# EAGLE design SparkFun_Noisy_Cricket (EAGLE 9.6.2)
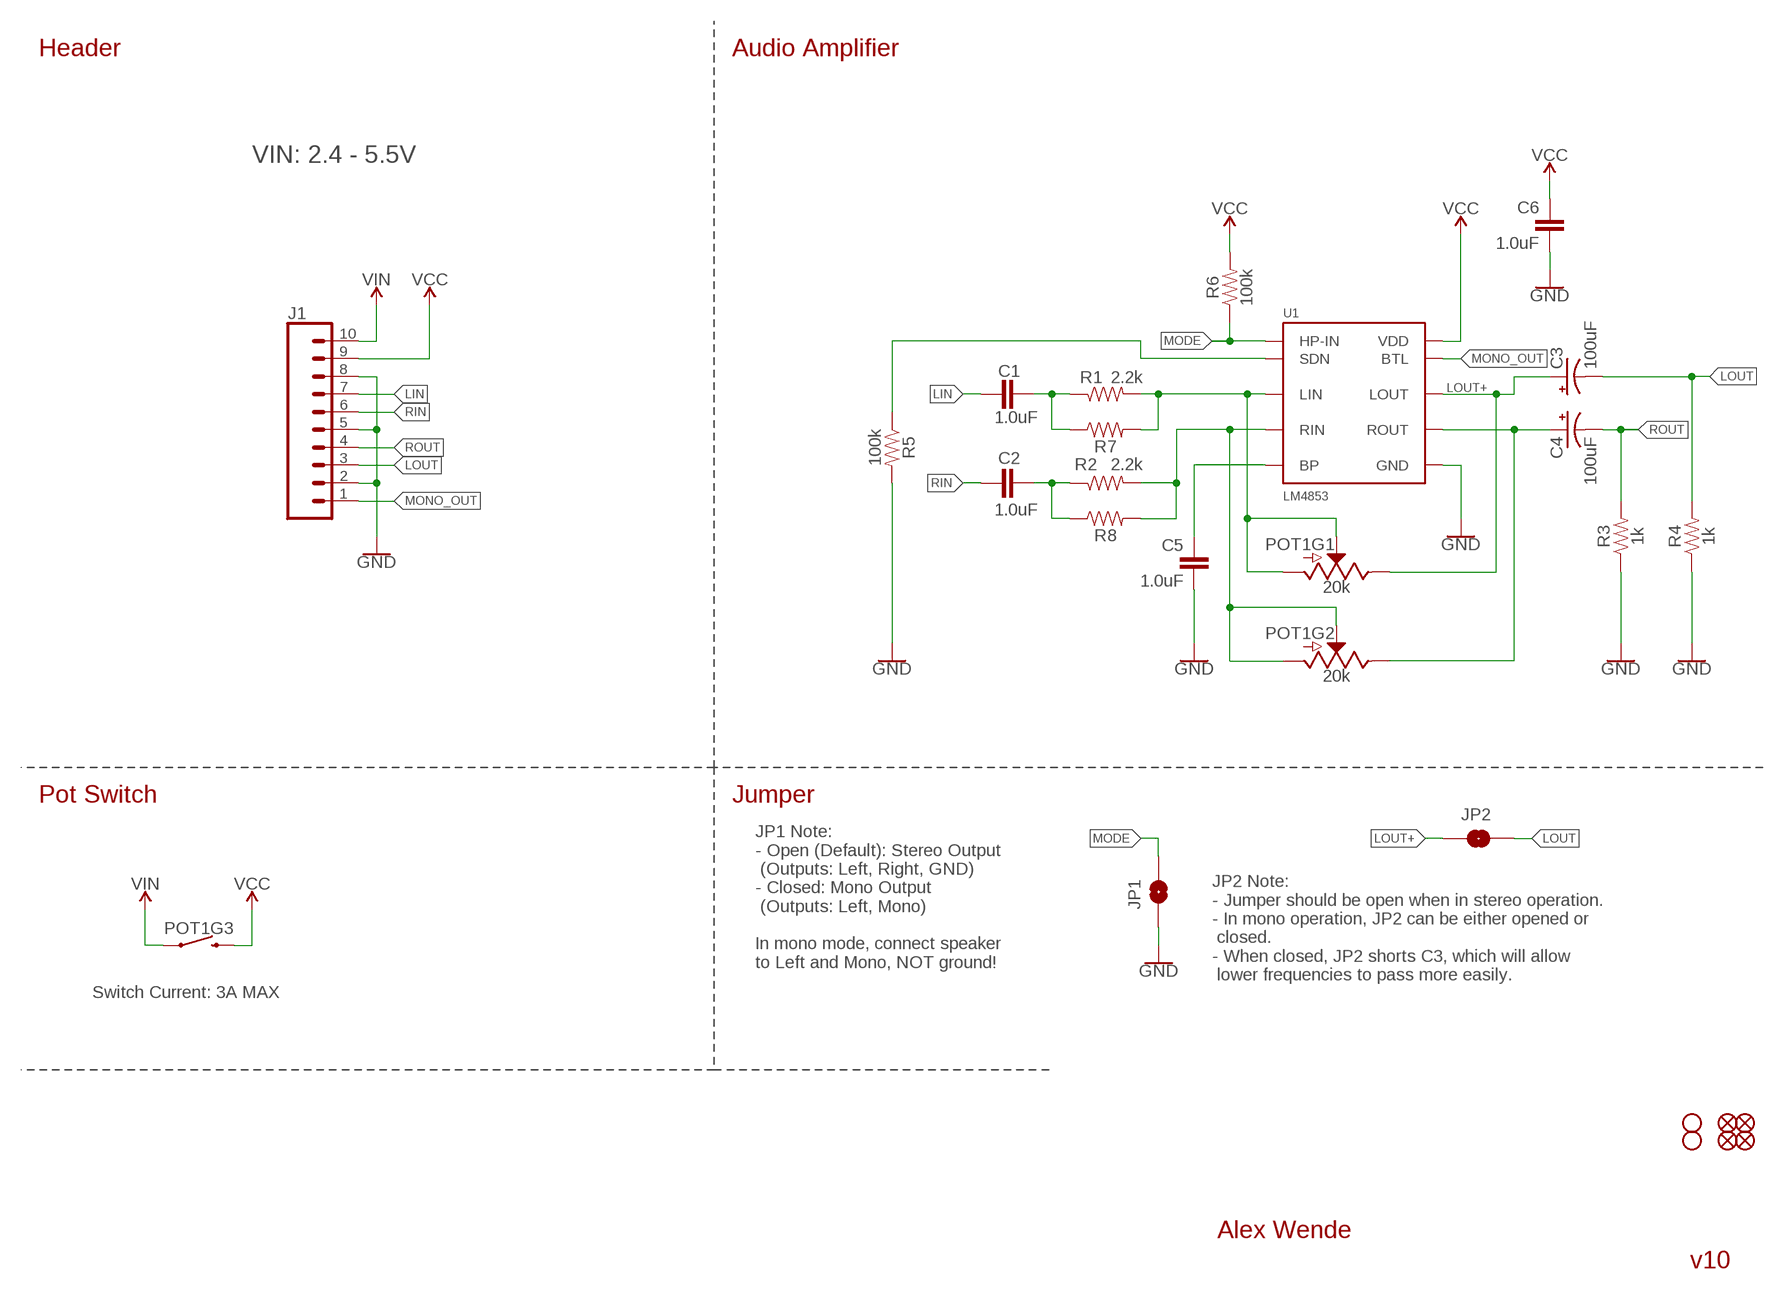
[diagram p0: schematic, sheet 1]

## Parts
C1  1.0uF  1.0UF-0603-16V-10%-X7R  [0603]
C2  1.0uF  1.0UF-0603-16V-10%-X7R  [0603]
C3  100uF  100UF-POLAR-25V-20%(ELEC)  [PANASONIC_D]
C4  100uF  100UF-POLAR-25V-20%(ELEC)  [PANASONIC_D]
C5  1.0uF  1.0UF-0603-16V-10%-X7R  [0603]
C6  1.0uF  1.0UF-0603-16V-10%-X7R  [0603]
FD1  FIDUCIALUFIDUCIAL  [FIDUCIAL-MICRO]
FD2  FIDUCIALUFIDUCIAL  [FIDUCIAL-MICRO]
FD3  FIDUCIALUFIDUCIAL  [FIDUCIAL-MICRO]
FD4  FIDUCIALUFIDUCIAL  [FIDUCIAL-MICRO]
H1  STAND-OFF  [STAND-OFF]
H2  STAND-OFF  [STAND-OFF]
J1  CONN_10NO_SILK_PTH_FEMALE  [1X10_NO_SILK]
JP1  JUMPER-SMT_2_NO_NO-SILK  [SMT-JUMPER_2_NO_NO-SILK]
JP2  JUMPER-SMT_2_NO_NO-SILK  [SMT-JUMPER_2_NO_NO-SILK]
POT1  20k  POTENTIOMETER_DUAL_W/SWITCH  [POT-DUAL-SWITCH-PTH]
R1  2.2k  2.2KOHM-0603-1/10W-1%  [0603]
R2  2.2k  2.2KOHM-0603-1/10W-1%  [0603]
R3  1k  1KOHM-0603-1/10W-1%  [0603]
R4  1k  1KOHM-0603-1/10W-1%  [0603]
R5  100k  100KOHM-0603-1/10W-1%  [0603]
R6  100k  100KOHM-0603-1/10W-1%  [0603]
R7  RESISTORAXIAL-0.3-KIT  [AXIAL-0.3-KIT]
R8  RESISTORAXIAL-0.3-KIT  [AXIAL-0.3-KIT]
U1  LM4853  [TFSOP-10]

## Nets
5V: C6.1 J1.9 POT1.SW2 R6.2 U1.VDD ; supply symbol labelled VCC
GND: C5.2 C6.2 J1.2 J1.5 J1.8 JP1.1 R3.1 R4.1 R5.2 U1.GND
LIN: C1.1 J1.7
LOUT: C3.- J1.3 JP2.2 R4.2
LOUT+: C3.+ JP2.1 POT1.A3(E) U1.LOUT
MODE: JP1.2 R6.1 U1.HP-IN
MONO_OUT: J1.1 U1.BTL
N$3: C1.2 R1.1 R7.P$1
N$5: C5.1 U1.BP
N$6: C2.2 R2.1 R8.P$1
N$9: R5.1 U1.SDN
N$12: C4.+ POT1.B3(E) U1.ROUT
N$21: POT1.A1(A) POT1.A2(S) R1.2 R7.P$2 U1.LIN
N$24: POT1.B1(A) POT1.B2(S) R2.2 R8.P$2 U1.RIN
RIN: C2.1 J1.6
ROUT: C4.- J1.4 R3.2
VIN: J1.10 POT1.SW1

## Notes on the sheet
- Header | Audio Amplifier
- VIN: 2.4 - 5.5V
- Pot Switch | Jumper
- JP1 Note:
  - Open (Default): Stereo Output
   (Outputs: Left, Right, GND)
  - Closed: Mono Output
   (Outputs: Left, Mono)
  
  In mono mode, connect speaker 
  to Left and Mono, NOT ground!
- JP2 Note:
  - Jumper should be open when in stereo operation.
  - In mono operation, JP2 can be either opened or
   closed.
  - When closed, JP2 shorts C3, which will allow
   lower frequencies to pass more easily.
- Switch Current: 3A MAX
- Alex Wende
- v10

## Library data of the parts
C1 C2 C5 C6 = SparkFun-Capacitors:1.0UF: 1µF ceramic capacitors A capacitor is a passive two-terminal electrical component used to store electrical energy temporarily in an electric field.; PROD_ID: CAP-13930
C3 C4 = SparkFun-Capacitors:100UF-POLAR: 100µF polarized capacitors A capacitor is a passive two-terminal electrical component used to store electrical energy temporarily in an electric field.; PROD_ID: CAP-12547
FD1-FD4 = SparkFun-Aesthetics:FIDUCIAL: Fiducial Alignment Points Point-of-reference for pick-and-place machines and other optical instruments.
H1 H2 = SparkFun-Hardware:STAND-OFF: Stand Off Drill holes for mechanically mounting via screws, standoffs, etc. Note: Use the keepout ring to avoid running the screw head into surrounding components. Variant Overviews STAND-OFF - Mechanical footprint for a #4 phillips button head screw. STAND-OFF-TIGHT - Mechanical footprint for a #4 phillips button head screw, Example SparkFun Products Screw - Phillips Head (1/4", 4-40, 10 pack) <https://www.sparkfun.com/products/10453> (PRT-10453) Screw - Phillips Head (1/2", 4-40, 10 pack) <https://www.sparkfun.com/products/10452> (PRT-10452) Screw - Phillips Head (3/4", 4-40, 10 pack) <https://www.sparkfun.com/products/10451> (PRT-10451) Screw - Phillips Head (1", 4-40, 10 pack) <https://www.sparkfun.com/products/10450> (PRT-10450)
J1 = SparkFun-Connectors:CONN_10: Multi connection point. Often used as Generic Header-pin footprint for 0.1 inch spaced/style header connections On any of the 0.1 inch spaced packages, you can populate with these: Break Away Headers - Straight <https://www.sparkfun.com/products/116> (PRT-00116) Break Away Male Headers - Right Angle <https://www.sparkfun.com/products/553> (PRT-00553) Female Headers <https://www.sparkfun.com/products/115> (PRT-00115) Break Away Headers - Machine Pin <https://www.sparkfun.com/products/117> (PRT-00117) Break Away Female Headers - Swiss Machine Pin <https://www.sparkfun.com/products/743> (PRT-00743) Arduino Stackable Header - 10 Pin <https://www.sparkfun.com/products/11376> (PRT-11376) For SCREWTERMINALS and SPRING TERMINALS visit here: Screw Terimnals on SparkFun.com <https://www.sparkfun.com/search/results?term=Screw+Terminals> (5mm/3.5mm/2.54mm spacing) This device is also useful as a general connection point to wire up your design to another part of your project. Our various solder wires solder well into these plated through hole pads. Hook-Up Wire - Assortment (Stranded, 22 AWG) <https://www.sparkfun.com/products/11375> (PRT-11375) Hook-Up Wire - Assortment (Solid Core, 22 AWG) <https://www.sparkfun.com/products/11367> (PRT-11367) View the entire wire category on our website here <https://www.sparkfun.com/categories/141> Special notes: Molex polarized connector foot print use with SKU : PRT-08231 with associated crimp pins and housings. 1MM SMD Version SKU: PRT-10208 NOTES ON THE VARIANTS LOCK and LOCK_LONGPADS... This footprint was designed to help hold the alignment of a through-hole component (i.e. 6-pin header) while soldering it into place. You may notice that each hole has been shifted either up or down by 0.005 of an inch from it's more standard position (which is a perfectly straight line). This slight alteration caused the pins (the squares in the middle) to touch the edges of the holes. Because they are alternating, it causes a "brace" to hold the component in place. 0.005 has proven to be the perfect amount of "off-center" position when using our standard breakaway headers. Although looks a little odd when you look at the bare footprint, once you have a header in there, the alteration is very hard to notice. Also,if you push a header all the way into place, it is covered up entirely on the bottom side.; PROD_ID: CONN-11563
JP1 JP2 = SparkFun-Jumpers:JUMPER-SMT_2_NO: Normally open jumper This jumper has two pads in close proximity to each other. Apply solder to close the connection. Round pads are easier to solder for beginners, but are a lot larger. SparkFun Product that uses the round pads: SparkFun EL Sequencer <https://www.sparkfun.com/products/12781>
POT1 = SparkFun-Resistors:POTENTIOMETER_DUAL_W/SWITCH; PROD_ID: RES-13814
R1 R2 = SparkFun-Resistors:2.2KOHM: 2.2kΩ resistor A resistor is a passive two-terminal electrical component that implements electrical resistance as a circuit element. Resistors act to reduce current flow, and, at the same time, act to lower voltage levels within circuits. - Wikipedia; PROD_ID: RES-08272
R3 R4 = SparkFun-Resistors:1KOHM: 1kΩ resistor A resistor is a passive two-terminal electrical component that implements electrical resistance as a circuit element. Resistors act to reduce current flow, and, at the same time, act to lower voltage levels within circuits. - Wikipedia; PROD_ID: RES-07856
R5 R6 = SparkFun-Resistors:100KOHM: 100kΩ resistor A resistor is a passive two-terminal electrical component that implements electrical resistance as a circuit element. Resistors act to reduce current flow, and, at the same time, act to lower voltage levels within circuits. - Wikipedia; PROD_ID: RES-07828
R7 R8 = SparkFun-Resistors:RESISTOR: Generic Resistor Package
U1 = SparkFun-IC-Amplifiers:LM4853; PROD_ID: IC-13812

## Board
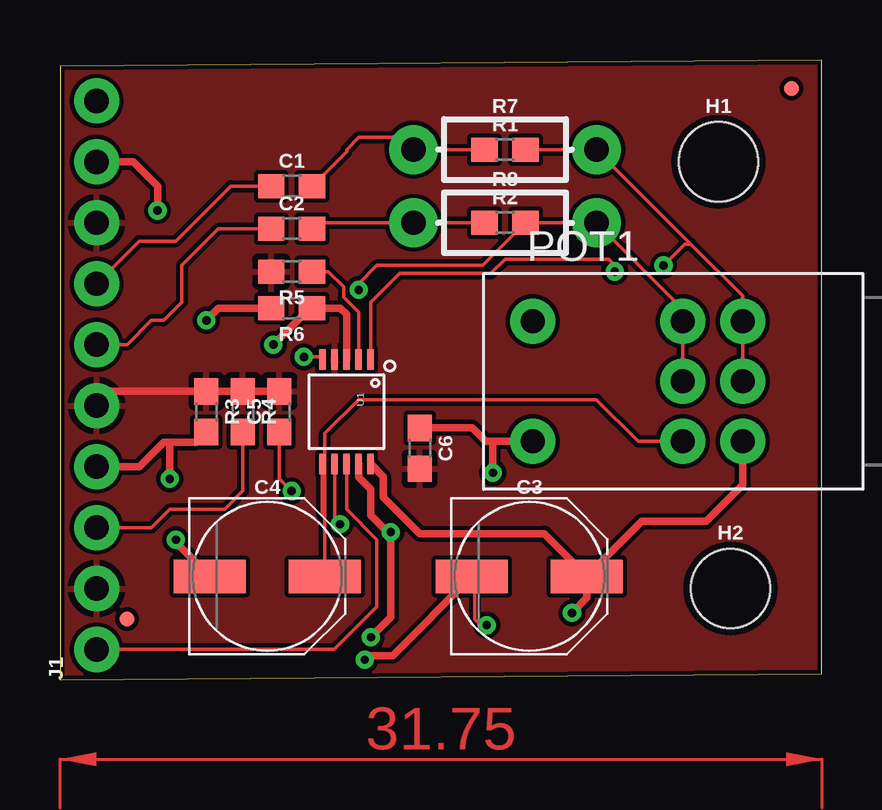
[diagram p1: board, top side]
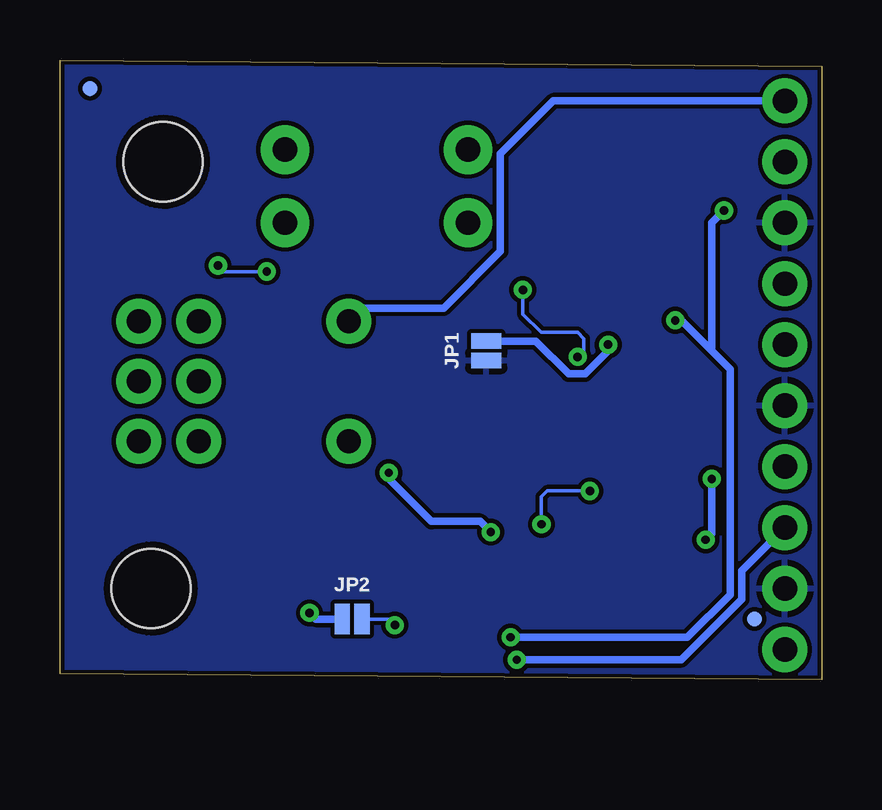
[diagram p2: board, bottom side, seen from below]

Size 31.73 x 25.83 mm. Coordinates in mm from the lower left corner, seen from the top.
Outline: 0,0 31.73,0.25 31.73,25.83 0,25.58 0,0
Copper layers (1*16): Top 0.035mm / dielectric 1.5mm / Bottom 0.035mm
Design rules "default *": minimum track width 6mil, minimum drill 0.35mm, track to track 7mil, track to pad 7mil, pad to pad 7mil, via to via 7mil, smd to smd 7mil, copper to edge 7mil, drill to drill 7mil, minimum pad ring 10mil, minimum via ring 8mil, stop-mask expansion 4mil, vias tented up to drill 0mil, thermal gap 10mil

### Footprints (pad centres in the part's own frame; a part is rotated, then mirrored left to right if it is on the bottom)
0603 = smd 1.1 x 1: 1 -0.85,0; 2 0.85,0
PANASONIC_D = smd 3 x 1.4: + 2.4,0; - -2.4,0
FIDUCIAL-MICRO = smd 0.635 x 0.635: 1 0,0
STAND-OFF = hole 3.302: 0,0
1X10_NO_SILK = drill 1.016 pad 1.88: 1 0,0; 2 2.54,0; 3 5.08,0; 4 7.62,0; 5 10.16,0; 6 12.7,0; 7 15.24,0; 8 17.78,0; 9 20.32,0; 10 22.86,0
SMT-JUMPER_2_NO_NO-SILK = smd 0.635 x 1.27: 1 -0.406,0; 2 0.406,0
POT-DUAL-SWITCH-PTH = drill 1 pad 1.88: A1 2.54,2.5; A2 2.54,0; A3 2.54,-2.5; B1 0.04,2.5; B2 0.04,0; B3 0.04,-2.5; SW1 -6.21,2.5; SW2 -6.21,-2.5
AXIAL-0.3-KIT = drill 1.016 pad 2.032: P$1 -3.81,0; P$2 3.81,0
TFSOP-10 = smd 0.85 x 0.29: BP 2.175,-0.5; BTL 2.175,0; GND -2.175,-0.5; HP-IN -2.175,0; LIN -2.175,1; LOUT 2.175,1; RIN -2.175,-1; ROUT 2.175,-1; SDN -2.175,0.5; VDD 2.175,0.5

### Placement (x,y rotation side)
C1  9.65,20.57 0 top
C2  9.65,18.8 0 top
C3  19.56,4.32 0 top
C4  8.64,4.32 0 top
C5  9.14,11.18 90 top
C6  14.99,9.65 270 top
FD1  30.48,24.64 0 top
FD2  2.79,2.54 0 bottom
FD3  30.48,24.64 0 bottom
FD4  2.79,2.54 0 top
H1  27.43,21.59 0 top
H2  27.94,3.81 0 top
J1  1.52,1.27 90 top
JP1  13.97,13.72 90 bottom
JP2  19.56,2.54 0 bottom
POT1  25.91,12.45 0 top
R1  18.54,22.1 0 top
R2  18.54,19.05 0 top
R3  6.1,11.18 270 top
R4  7.62,11.18 270 top
R5  9.65,17.02 180 top
R6  9.65,15.49 180 top
R7  18.54,22.1 0 top
R8  18.54,19.05 0 top
U1  11.94,11.18 270 top

### Tracks (layer width: path | path; a pad name or v marks a point on that pad's centre or on a via)
5V  (via drill 0.35)
  Top 0.305: POT1.SW2 18.03,9.95 | 18.03,9.95 17.74,9.95 17.18,10.5 C6.1 14.64,10.5 | U1.VDD 12.46,8.98 12.46,8.45 12.95,7.95 12.95,6.86 13.72,6.1 v13.78,6.16 13.78,2.61 v12.95,1.78 | v18.03,8.64 18.03,9.95 | v6.1,14.99 6.6,15.49 R6.2 | J1.9 3.05,21.59 4.06,20.57 v4.06,19.56
  Bottom 0.305: v13.78,6.16 14.22,6.6 16.26,6.6 18.03,8.38 v18.03,8.64 | v12.95,1.78 5.59,1.78 3.81,3.56 3.81,12.95 4.57,13.72 | v6.1,14.99 5.84,14.99 4.57,13.72 | v4.06,19.56 4.57,19.05 4.57,13.72
GND
  Top 0.305: C5.2 R4.1 R3.1 2.12,12.03 J1.5
  pour Top: -0.51,26.42 32.26,26.42 32.26,-1.02 -0.51,-1.02
  pour Bottom: -0.51,26.92 33.02,26.92 33.02,-1.52 -0.51,-1.52
LIN
  Top 0.152: J1.7 3.3,18.29 4.83,18.29 7.11,20.57 C1.1
LOUT  (via drill 0.35)
  Top 0.152: R4.2 7.62,7.87 6.86,7.11 4.57,7.11 3.81,6.35 J1.3 | C3.- 17.27,4.2 17.27,2.54 17.53,2.29 v17.78,2.29
  Top 0.305: C3.- 13.86,1.02 12.7,1.02 v12.7,0.84
  Bottom 0.152: v17.78,2.29 18.03,2.54 JP2.2
  Bottom 0.305: J1.3 3.33,4.55 3.33,3.36 5.84,0.84 v12.7,0.84
LOUT+  (via drill 0.35)
  Top 0.305: U1.LOUT 13.46,8.48 13.46,7.62 14.99,6.1 20.18,6.1 C3.+ | C3.+ 21.96,3.42 v21.34,2.79 | C3.+ 24.24,6.6 26.92,6.6 28.45,8.13 POT1.A3
  Bottom 0.305: v21.34,2.79 21.08,2.54 JP2.1
MODE  (via drill 0.35)
  Top 0.305: U1.HP-IN 11.94,15.24 11.68,15.49 R6.1 10.41,15.49 v8.89,13.97
  Bottom 0.305: JP1.2 11.9,14.12 10.53,12.75 9.85,12.75 8.89,13.72 v8.89,13.97
MONO_OUT
  Top 0.152: U1.BTL 11.94,7.11 13.21,5.84 13.21,3.05 11.43,1.27 J1.1
N$3
  Top 0.152: C1.2 11.94,22.01 11.94,22.1 12.45,22.61 14.22,22.61 R7.P$1 R1.1
N$5  (via drill 0.35)
  Top 0.152: C5.1 9.14,8.38 v9.65,7.87 | v11.67,6.49 11.44,6.72 U1.BP
  Bottom 0.152: v9.65,7.87 11.43,7.87 11.67,7.64 v11.67,6.49
N$6
  Top 0.152: R2.1 R8.P$1 10.76,19.05 C2.2
N$9
  Top 0.152: R5.1 11.18,17.02 11.81,16.38 11.81,15.94 12.44,15.31 U1.SDN
N$12
  Top 0.152: 11.04,4.57 11.04,6.74 | 11.04,6.74 10.92,6.86 10.92,8.98 U1.ROUT | 11.04,6.74 11.04,10.27 12.45,11.68 22.35,11.68 24.09,9.95 POT1.B3
  Top 0.305: C4.+ 11.04,4.57
N$21  (via drill 0.35)
  Top 0.152: R1.2 R7.P$2 26.29,18.16 | 26.29,18.16 28.45,16 POT1.A1 POT1.A2 | U1.LIN 12.94,15.73 14.15,16.94 17.96,16.94 18.54,17.53 22.86,17.53 23.11,17.27 v23.11,17.02 | v25.15,17.27 26.04,18.16 26.29,18.16
  Bottom 0.152: v23.11,17.02 24.89,17.02 v25.15,17.27
N$24  (via drill 0.35)
  Top 0.152: v12.45,16.26 12.45,16.51 13.21,17.27 17.61,17.27 R2.2 R8.P$2 25.95,15.45 POT1.B1 POT1.B2 | v10.16,13.46 10.83,13.46 U1.RIN
  Bottom 0.152: v12.45,16.26 12.45,15.24 11.68,14.48 10.16,14.48 9.91,14.22 9.91,13.72 v10.16,13.46
RIN
  Top 0.152: C2.1 6.6,18.8 5.08,17.27 5.08,15.75 4.32,14.99 3.81,14.99 2.79,13.97 J1.6
ROUT  (via drill 0.35)
  Top 0.305: J1.4 3.3,8.89 4.32,9.91 4.57,9.91 | R3.2 5.68,9.91 4.57,9.91 | v4.83,5.84 4.83,5.73 C4.- 6.86,4.32 | v4.57,8.38 4.57,9.91
  Bottom 0.305: v4.83,5.84 4.57,6.1 v4.57,8.38
VIN
  Bottom 0.305: J1.10 11.18,24.13 13.39,21.92 13.39,17.86 15.75,15.49 19.15,15.49 POT1.SW1
(copper drawn outside any net)
  shapes: Top area x2